# EasyEDA Pro project ProDoc_ChisFlash-Pichu.epro

# Schematic ChisFlash-Pichu-圆角长金手指-二极管-隔离CS2
Board Name: ChisFlash-Pichu-圆角长金手指-二极管-隔离CS2; Create Date: 2024-10-19; Page Name: P1; Project Name: ChisFlash V0.1 青春版 开源GBA烧录卡; Schematic Name: ChisFlash-Pichu-圆角长金手指-二极管-隔离CS2; Update Date: 2024-10-19; Company: ChisBread/ChisFlash-Prometheus; Drawed: ChisBread; Page Size: A4; Reviewed: ChisBread; Version: 2
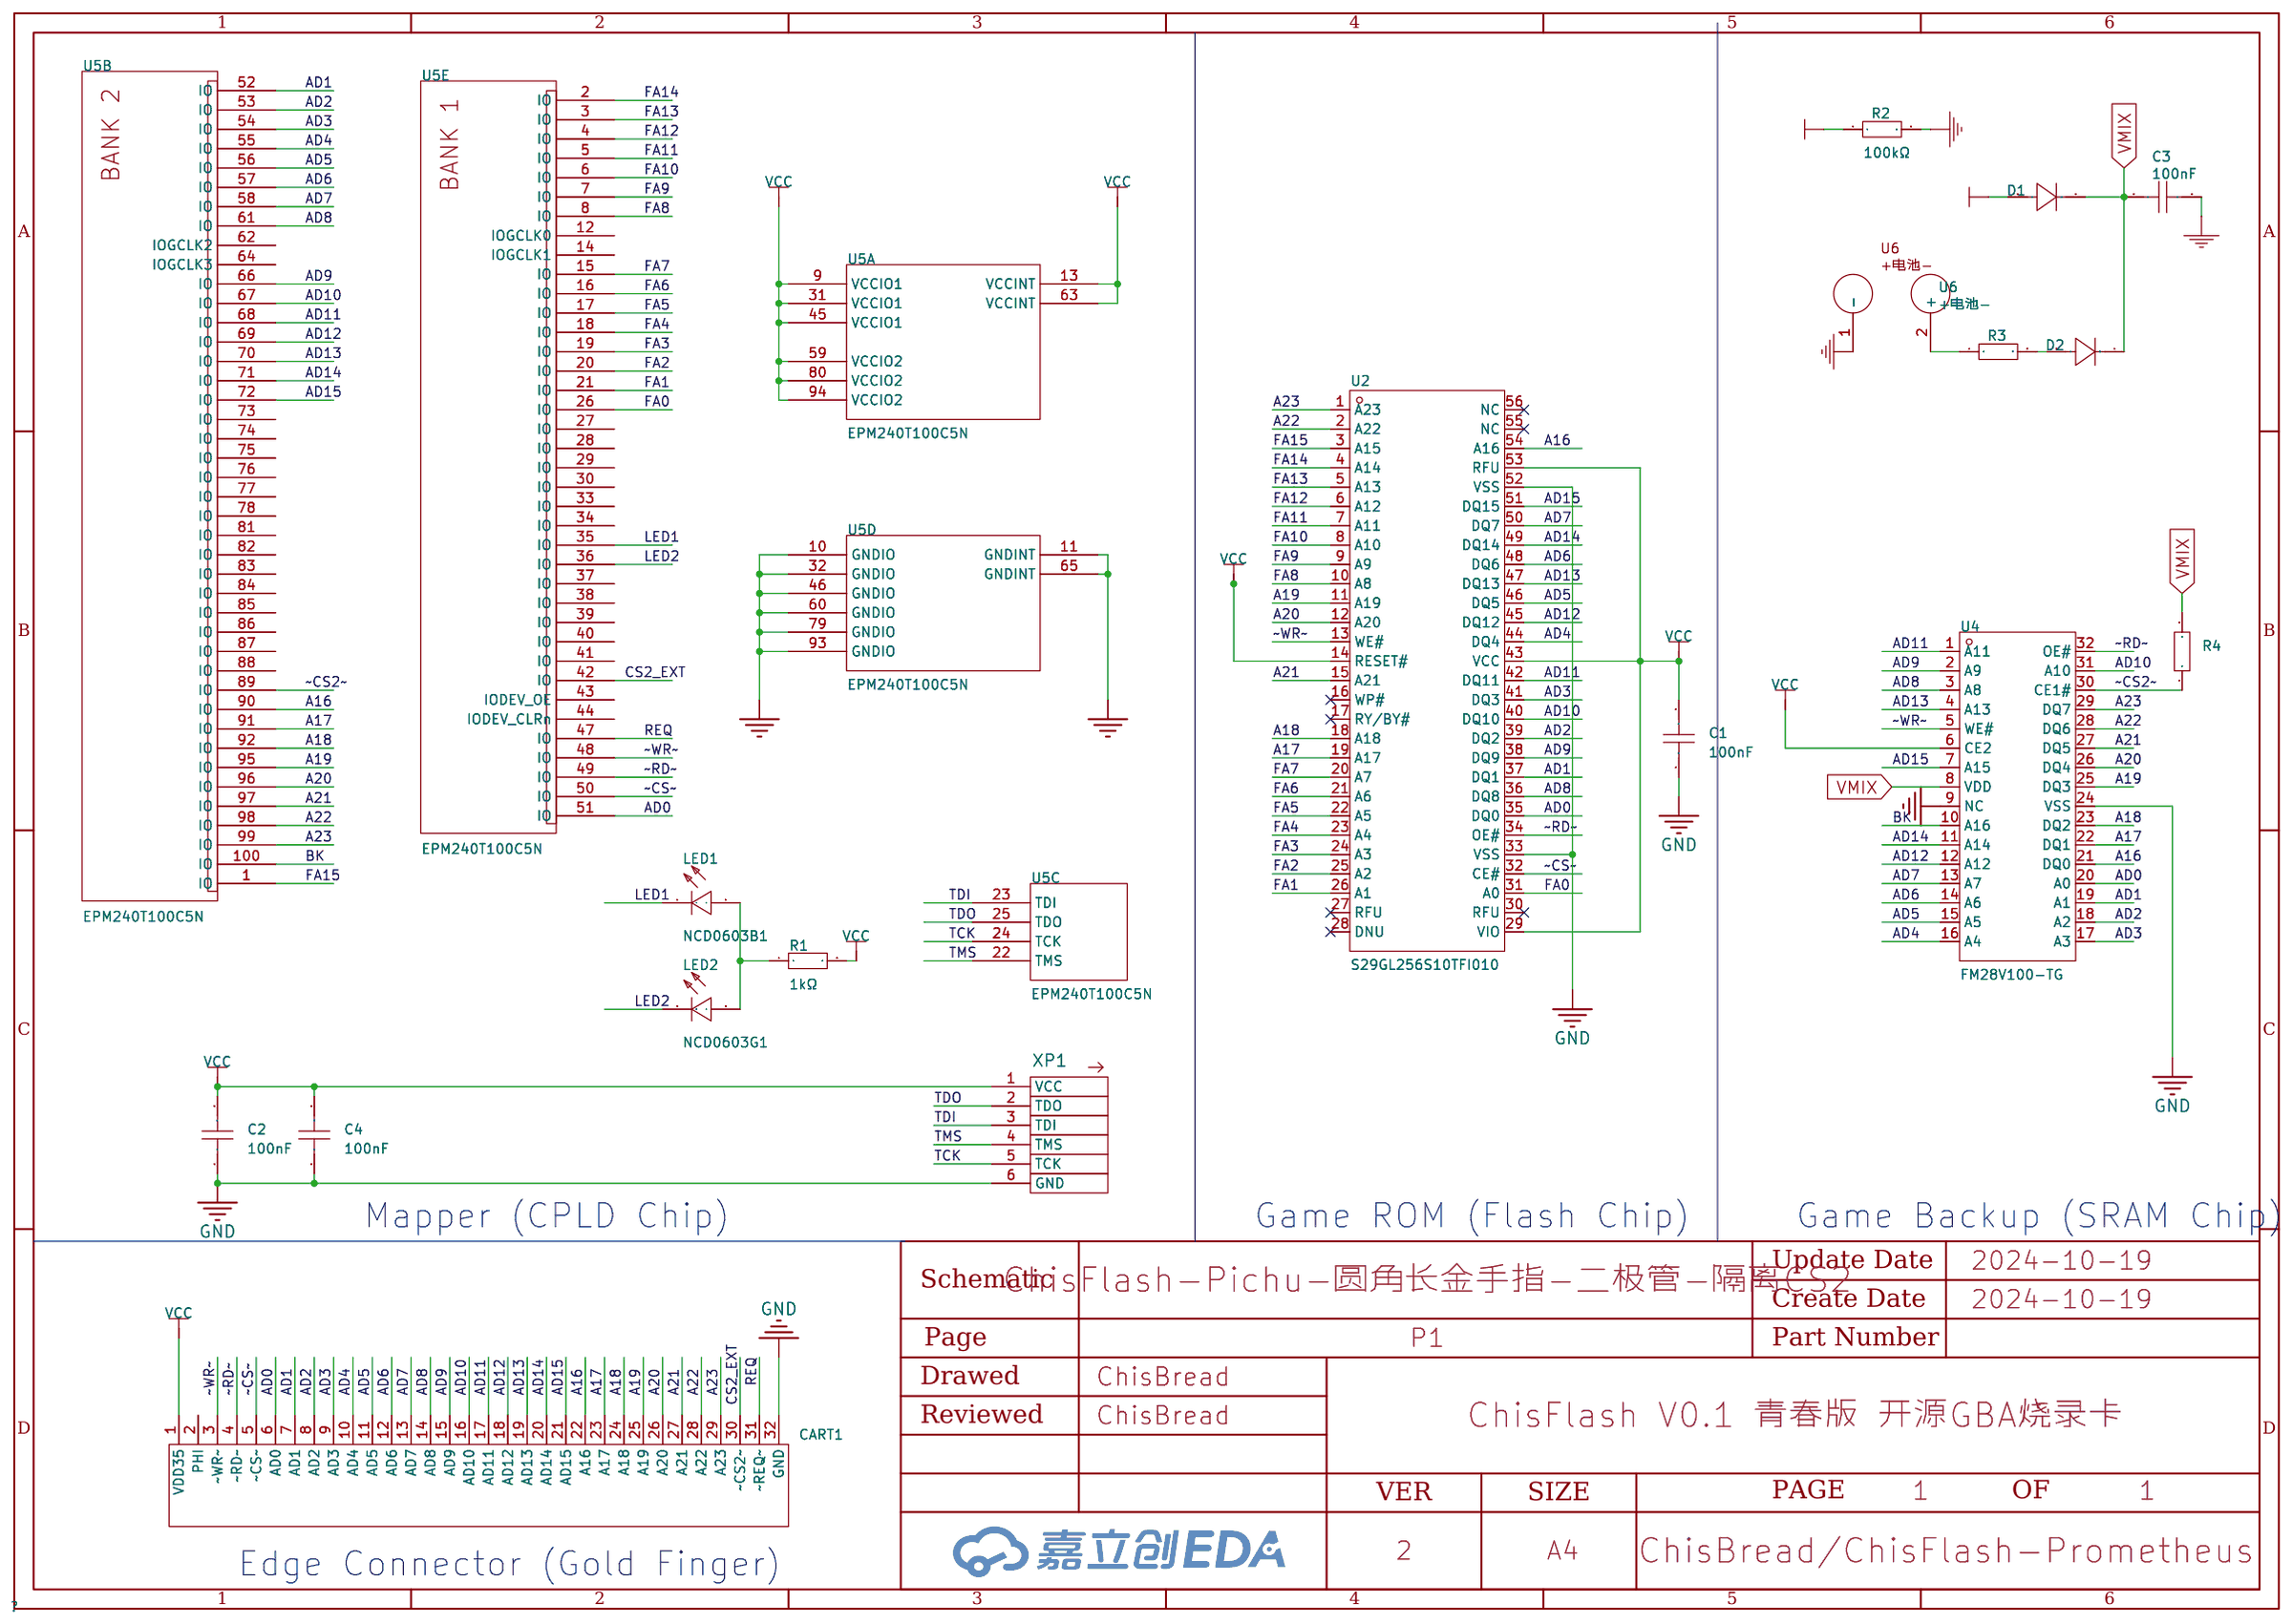
[diagram p0: schematic sheet]

## Parts
C1  100nF  [C0603]
C2  100nF  [C0603]
C3  100nF  [C0603]
C4  100nF  [C0603]
CART1  -  [GBA卡带金手指]  (no BOM)
D1  1N4148WS  [SOD-323_L1.8-W1.3-LS2.5-RD]
D2  1N4148WS  [SOD-323_L1.8-W1.3-LS2.5-RD]
LED1  NCD0603B1  [LED0603-RD]
LED2  NCD0603G1  [LED0603-RD]
R1  1kΩ  [R0603]
R2  100kΩ  [R0603]
R3  10kΩ  [R0603]
R4  10kΩ  [R0603]
U2  S29GL256S10TFI010  [TSOP-56_L18.4-W14.0-P0.50-LS20.0-TL]
U4  FM28V100-TG  [STSOP-32_L8.0-W11.8-P0.50-LS13.4-TL]
U5  EPM240T100C5N  [TQFP-100_L14.0-W14.0-P0.50-LS16.0-BL]  (sections 1,2,3,4,5)
U6  +电池-  [电池2]
XP1  JTAG  [HDR-TH_6P-P1.27-V-M-1]  (no BOM)

## Library data of the parts
C1 C2 C4 = CAP_0603: Supplier Footprint: 0603; Supplier Part: C14663
C3 = CGA0603X7R104K500JT: 容值:100nF;精度:±10%;额定电压:50V;材质(温度系数):X7R;; LCSC Part Name: 100nF ±10% 50V; Supplier Part: C14663; Manufacturer: HRE(芯声); Supplier Footprint: 0603; JLCPCB Part Class: Extended Part; Supplier: LCSC; Tolerance: ±10%; Voltage Rated: 50V; Temperature Coefficient: X7R
CART1 = GBA卡带金手指
D1 D2 = 1N4148WS_C917117: 二极管配置:独立式;正向压降(Vf):1.25V@150mA;直流反向耐压(Vr):100V;平均整流电流(Io):300mA;功率:400mW;反向恢复时间(trr):8ns;; LCSC Part Name: 电压:100V 电流:300mA; Supplier Part: C917117; Manufacturer: JSMSEMI(杰盛微); Supplier Footprint: SOD-323; JLCPCB Part Class: Extended Part; Datasheet: https://atta.szlcsc.com/upload/public/pdf/source/20230807/08D9F448A82EA88A23B325A669586A09.pdf; Supplier: LCSC; Diode Configuration: 独立式; Forward Voltage (Vf@If): 1.25V@150mA; Reverse Voltage (Vr): 100V; Average Rectified Current (Io): 300mA; Power Dissipation: 400mW; Reverse Leakage Current: 1uA@75V; Reverse Recovery Time (trr): 8ns; Operating Temperature: -55℃~+150℃@(Tj)
LED1 = NCD0603B1: 发光颜色:蓝色;正向电压(VF):2.6V~3.6V;功率:72mW;正向电流:10mA;主波长:463nm~475nm;透镜颜色:无色透明透镜;发光强度:80mcd~220mcd;发光角度:130°;工作温度:-30℃~+85℃;; Supplier Part: C84266; Manufacturer: 国星光电; Supplier Footprint: 0603; JLCPCB Part Class: 扩展库; Datasheet: https://atta.szlcsc.com/upload/public/pdf/source/20200820/C84266_6A3CDBEFA72C6CAD68EDA53474ADAE6C.pdf; Supplier: LCSC; Emitted Color: 蓝色; Forward Voltage (VF): 2.6V~3.6V; Power Dissipation: 72mW; Forward Current: 10mA; Dominant Wavelength: 463nm~475nm; Lens Color: 无色透明透镜; Luminous Intensity: 80mcd~220mcd; Viewing Angle: 130°; Operating Temperature: -30℃~+85℃
LED2 = NCD0603G1: 发光颜色:翠绿色;正向电压(VF):2.6V~3.6V;功率:72mW;正向电流:10mA;主波长:515nm~530nm;透镜颜色:无色透明透镜;发光强度:330mcd~900mcd;发光角度:130°;工作温度:-30℃~+85℃;; Supplier Part: C84266; Manufacturer: 国星光电; Supplier Footprint: 0603; JLCPCB Part Class: 扩展库; Datasheet: https://atta.szlcsc.com/upload/public/pdf/source/20200820/C84267_04BA7703640BAC111D09F5EFB971FBF3.pdf; Supplier: LCSC; Emitted Color: 翠绿色; Forward Voltage (VF): 2.6V~3.6V; Power Dissipation: 72mW; Forward Current: 10mA; Dominant Wavelength: 515nm~530nm; Lens Color: 无色透明透镜; Luminous Intensity: 330mcd~900mcd; Viewing Angle: 130°; Operating Temperature: -30℃~+85℃
R1 = 0603WAF1001T5E: 电阻类型:厚膜电阻;阻值:1kΩ;精度:±1%;功率:100mW;最大工作电压:75V;温度系数:±100ppm/℃;; LCSC Part Name: 1kΩ ±1% 100mW 厚膜电阻; Supplier Part: C25803; Manufacturer: UNI-ROYAL(厚声); Supplier Footprint: 0603; JLCPCB Part Class: 基础库; Datasheet: https://atta.szlcsc.com/upload/public/pdf/source/20200306/C422600_1E6D84923E4A46A82E41ADD87F860B5C.pdf; Supplier: LCSC; Type: 厚膜电阻; Tolerance: ±1%; Power(Watts): 100mW; Overload Voltage (Max): 75V; Temperature Coefficient: ±100ppm/℃; Operating Temperature Range: -55℃~+155℃
R2 = 0603WAF1003T5E: 电阻类型:厚膜电阻;阻值:100kΩ;精度:±1%;功率:100mW;最大工作电压:75V;温度系数:±100ppm/℃;; LCSC Part Name: 100kΩ ±1% 100mW 厚膜电阻; Supplier Part: C25803; Manufacturer: UNI-ROYAL(厚声); Supplier Footprint: 0603; JLCPCB Part Class: Basic Part; Datasheet: https://atta.szlcsc.com/upload/public/pdf/source/20200306/C422600_1E6D84923E4A46A82E41ADD87F860B5C.pdf; Supplier: LCSC; Type: 厚膜电阻; Tolerance: ±1%; Power(Watts): 100mW; Overload Voltage (Max): 75V; Temperature Coefficient: ±100ppm/℃; Operating Temperature Range: -55℃~+155℃; Resistance: 47K
R3 R4 = 0603WAF1002T5E: 电阻类型:厚膜电阻;阻值:10kΩ;精度:±1%;功率:100mW;最大工作电压:75V;温度系数:±100ppm/℃;; LCSC Part Name: 厚膜电阻 10kΩ ±1% 100mW; Supplier Part: C25803; Manufacturer: UNI-ROYAL(厚声); Supplier Footprint: 0603; JLCPCB Part Class: Basic Part; Datasheet: https://atta.szlcsc.com/upload/public/pdf/source/20200306/C422600_1E6D84923E4A46A82E41ADD87F860B5C.pdf; Supplier: LCSC; Type: 厚膜电阻; Tolerance: ±1%; Power(Watts): 100mW; Overload Voltage (Max): 75V; Temperature Coefficient: ±100ppm/℃; Operating Temperature Range: -55℃~+155℃; Resistance: 47K
U2 = S29GL256S10TFI010: Supplier Part: C1350995; Manufacturer: SPANSION(飞索); Supplier Footprint: TSOP-56; JLCPCB Part Class: Extended Part; Datasheet: https://atta.szlcsc.com/upload/public/pdf/source/20201109/C914940_4A5E28132C9BE0EE19A790F58F84C86D.pdf; Supplier: LCSC
U4 = FM28V100-TG: Supplier Part: C2959453; Manufacturer: CYPRESS(赛普拉斯); Supplier Footprint: TFSOP-32; JLCPCB Part Class: 扩展库; Datasheet: https://atta.szlcsc.com/upload/public/pdf/source/20210608/2F2AEFEDCE558E0D37969C616959BD3C.pdf; Supplier: LCSC
U5 = EPM240T100C5N: 类型:其它PLD;逻辑门数量:-;逻辑单元数:-;逻辑阵列块数:240;; Supplier Part: C10041; Manufacturer: Intel/Altera; Supplier Footprint: TQFP-100(14x14); JLCPCB Part Class: 扩展库; Datasheet: https://atta.szlcsc.com/upload/public/pdf/source/20121123/1457706563537.pdf; Supplier: LCSC; Type: 其它PLD; Supply Voltage Range - VCCIO: 3.3V；2.5V; Logic Array Blocks: 240; Maximum Delay Time Tpd: 4.7ns; Operating Temperature Range: 0℃~+85℃
U6 = GBA烧录卡电池
XP1 = jtag

## Nets
GND: C1.1 C2.1 C3.2 C4.1 CART1.32(GND) R2.2 U2.33(VSS) U2.52(VSS) U4.9(NC) U4.24(VSS) U5.10(GNDIO) U5.11(GNDINT) U5.32(GNDIO) U5.46(GNDIO) U5.60(GNDIO) U5.65(GNDINT) U5.79(GNDIO) U5.93(GNDIO) U6.1(-) XP1.6(GND)
VCC: C1.2 C2.2 C4.2 CART1.1(VDD35) D1.2(A) R1.2 R2.1 U2.14(RESET#) U2.29(VIO) U2.43(VCC) U2.53(RFU) U4.6(CE2) U5.9(VCCIO1) U5.13(VCCINT) U5.31(VCCIO1) U5.45(VCCIO1) U5.59(VCCIO2) U5.63(VCCINT) U5.80(VCCIO2) U5.94(VCCIO2) XP1.1(VCC)
A16: CART1.22(A16) U2.54(A16) U4.21(DQ0) U5.90(IO)
A17: CART1.23(A17) U2.19(A17) U4.22(DQ1) U5.91(IO)
A18: CART1.24(A18) U2.18(A18) U4.23(DQ2) U5.92(IO)
A19: CART1.25(A19) U2.11(A19) U4.25(DQ3) U5.95(IO)
A20: CART1.26(A20) U2.12(A20) U4.26(DQ4) U5.96(IO)
A21: CART1.27(A21) U2.15(A21) U4.27(DQ5) U5.97(IO)
A22: CART1.28(A22) U2.2(A22) U4.28(DQ6) U5.98(IO)
A23: CART1.29(A23) U2.1(A23) U4.29(DQ7) U5.99(IO)
AD0: CART1.6(AD0) U2.35(DQ0) U4.20(A0) U5.51(IO)
AD1: CART1.7(AD1) U2.37(DQ1) U4.19(A1) U5.52(IO)
AD2: CART1.8(AD2) U2.39(DQ2) U4.18(A2) U5.53(IO)
AD3: CART1.9(AD3) U2.41(DQ3) U4.17(A3) U5.54(IO)
AD4: CART1.10(AD4) U2.44(DQ4) U4.16(A4) U5.55(IO)
AD5: CART1.11(AD5) U2.46(DQ5) U4.15(A5) U5.56(IO)
AD6: CART1.12(AD6) U2.48(DQ6) U4.14(A6) U5.57(IO)
AD7: CART1.13(AD7) U2.50(DQ7) U4.13(A7) U5.58(IO)
AD8: CART1.14(AD8) U2.36(DQ8) U4.3(A8) U5.61(IO)
AD9: CART1.15(AD9) U2.38(DQ9) U4.2(A9) U5.66(IO)
AD10: CART1.16(AD10) U2.40(DQ10) U4.31(A10) U5.67(IO)
AD11: CART1.17(AD11) U2.42(DQ11) U4.1(A11) U5.68(IO)
AD12: CART1.18(AD12) U2.45(DQ12) U4.12(A12) U5.69(IO)
AD13: CART1.19(AD13) U2.47(DQ13) U4.4(A13) U5.70(IO)
AD14: CART1.20(AD14) U2.49(DQ14) U4.11(A14) U5.71(IO)
AD15: CART1.21(AD15) U2.51(DQ15) U4.7(A15) U5.72(IO)
BK: U4.10(A16) U5.100(IO)
CS2_EXT: CART1.30(~CS2~) U5.42(IO)
FA0: U2.31(A0) U5.26(IO)
FA1: U2.26(A1) U5.21(IO)
FA2: U2.25(A2) U5.20(IO)
FA3: U2.24(A3) U5.19(IO)
FA4: U2.23(A4) U5.18(IO)
FA5: U2.22(A5) U5.17(IO)
FA6: U2.21(A6) U5.16(IO)
FA7: U2.20(A7) U5.15(IO)
FA8: U2.10(A8) U5.8(IO)
FA9: U2.9(A9) U5.7(IO)
FA10: U2.8(A10) U5.6(IO)
FA11: U2.7(A11) U5.5(IO)
FA12: U2.6(A12) U5.4(IO)
FA13: U2.5(A13) U5.3(IO)
FA14: U2.4(A14) U5.2(IO)
FA15: U2.3(A15) U5.1(IO)
LED1: LED1.1(-) U5.35(IO)
LED2: LED2.1(K) U5.36(IO)
REQ: CART1.31(~REQ~) U5.47(IO)
TCK: U5.24(TCK) XP1.5(TCK)
TDI: U5.23(TDI) XP1.3(TDI)
TDO: U5.25(TDO) XP1.2(TDO)
TMS: U5.22(TMS) XP1.4(TMS)
VMIX: C3.1 D1.1(C) D2.1(C) R4.2 U4.8(VDD)
~CS2~: R4.1 U4.30(CE1#) U5.89(IO)
~CS~: CART1.5(~CS~) U2.32(CE#) U5.50(IO)
~RD~: CART1.4(~RD~) U2.34(OE#) U4.32(OE#) U5.49(IO)
~WR~: CART1.3(~WR~) U2.13(WE#) U4.5(WE#) U5.48(IO)
$1N77583: LED1.2(+) LED2.2(A) R1.1
$1N81263: D2.2(A) R3.2
$1N81264: R3.1 U6.2(+)

Not connected (* = marked no-connect by the designer): CART1 2(PHI); U2 16(WP#)* 17(RY/BY#)* 27(RFU)* 28(DNU)* 30(RFU)* 55(NC)* 56(NC)*; U5 12(IOGCLK0) 14(IOGCLK1) 27(IO) 28(IO) 29(IO) 30(IO) 33(IO) 34(IO) 37(IO) 38(IO) 39(IO) 40(IO) 41(IO) 43(IODEV_OE) 44(IODEV_CLRn) 62(IOGCLK2) 64(IOGCLK3) 73(IO) 74(IO) 75(IO) 76(IO) 77(IO) 78(IO) 81(IO) 82(IO) 83(IO) 84(IO) 85(IO) 86(IO) 87(IO) 88(IO)

## Notes on the sheet
- Mapper (CPLD Chip)
- Game ROM (Flash Chip)
- Game Backup (SRAM Chip)
- Edge Connector (Gold Finger)

# Board ChisFlash-Pichu-圆角长金手指-二极管-隔离CS2
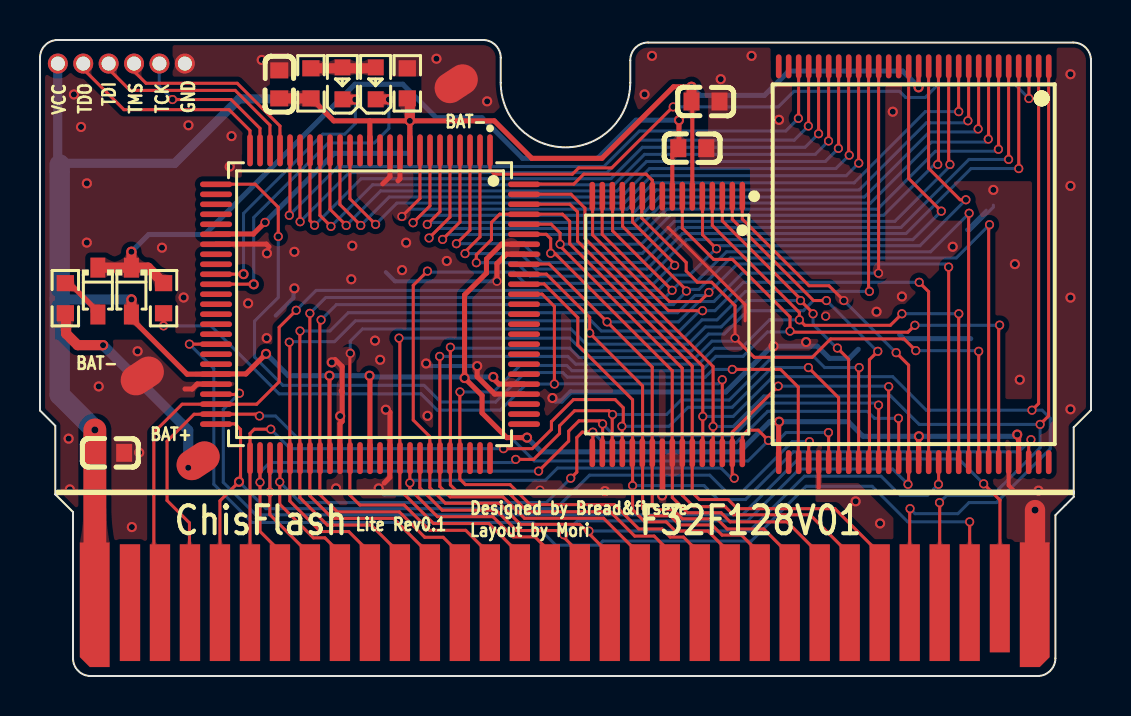
[diagram p1: board, top side]
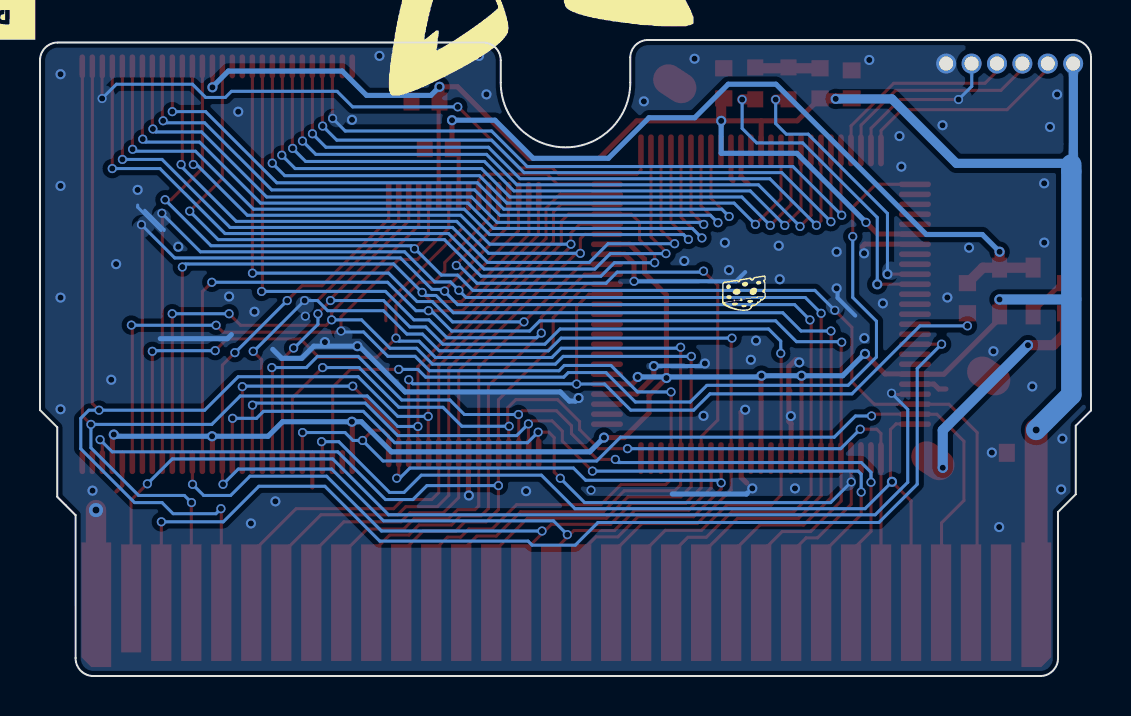
[diagram p2: board, bottom side, seen from below]

Outline 52.55 x 31.83 mm; copper layers: Top Layer, Bottom Layer. Coordinates in mm from the lower left corner of the outline.
Outline path: 0,30.94 0,13.28 0.76,12.52 0.76,9.09 1.65,8.2 1.65,0.89 arc(1.91,0.26) 2.54,0 49.88,0 arc(50.51,0.26) 50.77,0.89 50.77,8.05 51.28,8.56 51.69,8.97 51.69,12.45 52.55,13.31 52.55,30.81 arc(52.29,31.44) 51.66,31.7 30.4,31.7 arc(29.77,31.44) 29.51,30.81 29.51,29.69 arc(26.28,26.45) 23.04,29.69 23.04,30.94 arc(22.78,31.57) 22.15,31.83 0.89,31.83 arc(0.26,31.57) 0,30.94
Stack: Top Layer 0.035mm - / Dielectric1 1.51mm FR4 er 4.5 / Bottom Layer 0.035mm -

## Design rules (mm)
template: 自定义配置
spacing copperThickness1oz (default): track to track 0.152, other pairs 0.152 to 0.3
spacing copperThickness2oz: track to track 0.152, other pairs 0.152 to 0.3
track width copperThickness1oz (default): min 0.152, default 0.152, max 2.54
track width copperThickness2oz: min 0.152, default 0.254, max 2.54
differential pair differentialPair (default): width min 0.152, default 0.254, max 2.54; gap min 0.152, default 0.152
via viaSize (default): diameter min 0.406, default 0.508, max 10; hole min 0.305, default 0.305, max 6.299

## Placement (name value [footprint] x y rotation side)
C1  100nF  [C0603]  33.28 28.75 180 top
C2  100nF  [C0603]  11.96 29.6 270 top
C3  100nF  [C0603]  32.62 26.41 0 top
C4  100nF  [C0603]  3.51 11.17 180 top
CART1  -  [GBA卡带金手指]  26.22 3.04 0 top
D1  1N4148WS  [SOD-323_L1.8-W1.3-LS2.5-RD]  4.57 19.26 270 top
D2  1N4148WS  [SOD-323_L1.8-W1.3-LS2.5-RD]  2.89 19.26 270 top
LED1  NCD0603B1  [LED0603-RD]  15.13 29.66 90 top
LED2  NCD0603G1  [LED0603-RD]  16.79 29.66 90 top
NOREF  -  [Pad_e80923]  20.81 29.64 33.3 top
R1  1kΩ  [R0603]  13.55 29.66 270 top
R2  100kΩ  [R0603]  18.37 29.66 90 top
R3  10kΩ  [R0603]  1.27 18.91 90 top
R4  10kΩ  [R0603]  6.18 18.91 90 top
U2  S29GL256S10TFI010  [TSOP-56_L18.4-W14.0-P0.50-LS20.0-TL]  43.69 20.6 270 top
U4  FM28V100-TG  [STSOP-32_L8.0-W11.8-P0.50-LS13.4-TL]  31.37 17.59 270 top
U5  EPM240T100C5N  [TQFP-100_L14.0-W14.0-P0.50-LS16.0-BL]  16.5 18.6 180 top
U6  +电池-  [电池2]  5.11 15.02 303.3 top
XP1  JTAG  [HDR-TH_6P-P1.27-V-M-1]  4.07 30.65 0 top

## Footprints (pads in the part's own frame, mm; a bottom-side part is the same pattern mirrored in y, then rotated)
C0603
  rect 0.8x0.9 smd: 1(-0.7,0) 2(0.7,0)
GBA卡带金手指
  custom 1.491x6.239 smd: 1(-23.48,0.522)
  rect 1.016x5.842 smd: 2(-21.718,0.626) 3(-20.218,0.626) 4(-18.718,0.626) 5(-17.219,0.626) 6(-15.72,0.626) 7(-14.22,0.626) 8(-12.72,0.626) 9(-11.221,0.626) 10(-9.722,0.626) 11(-8.222,0.626) 12(-6.723,0.626) 13(-5.223,0.626) 14(-3.724,0.626) 15(-2.224,0.626) 16(-0.725,0.626) 17(0.775,0.626) 18(2.275,0.626) 19(3.774,0.626) 20(5.274,0.626) 21(6.773,0.626) 22(8.273,0.626) 23(9.772,0.626) 24(11.271,0.626) 25(12.771,0.626) 26(14.271,0.626) 27(15.77,0.626) 28(17.27,0.626) 29(18.769,0.626) 30(20.268,0.626)
  rect 1.001x5.407 smd: 31(21.776,0.844)
  custom 1.492x6.239 smd: 32(23.522,0.522)
HDR-TH_6P-P1.27-V-M-1
  round 1 hole 0.7: 1(-3.175,0) 2(-1.905,0) 3(-0.635,0) 4(0.635,0) 5(1.905,0) 6(3.175,0)
LED0603-RD
  rect 0.8x0.8 smd: 1(-0.799,0) 2(0.799,0)
Pad_e80923
  oval 2.286x1.524 smd: 2(0,0)
R0603
  rect 0.806x0.864 smd: 1(-0.753,0) 2(0.753,0)
SOD-323_L1.8-W1.3-LS2.5-RD
  rect 1x0.75 smd: 1(-1.173,0) 2(1.173,0)
STSOP-32_L8.0-W11.8-P0.50-LS13.4-TL
  oval 1.44x0.28 smd: 1(-6.42,3.75) 2(-6.42,3.25) 3(-6.42,2.75) 4(-6.42,2.25) 5(-6.42,1.75) 6(-6.42,1.25) 7(-6.42,0.75) 8(-6.42,0.25) 9(-6.42,-0.25) 10(-6.42,-0.75) 11(-6.42,-1.25) 12(-6.42,-1.75) 13(-6.42,-2.25) 14(-6.42,-2.75) 15(-6.42,-3.25) 16(-6.42,-3.75) 17(6.42,-3.75) 18(6.42,-3.25) 19(6.42,-2.75) 20(6.42,-2.25) 21(6.42,-1.75) 22(6.42,-1.25) 23(6.42,-0.75) 24(6.42,-0.25) 25(6.42,0.25) 26(6.42,0.75) 27(6.42,1.25) 28(6.42,1.75) 29(6.42,2.25) 30(6.42,2.75) 31(6.42,3.25) 32(6.42,3.75)
TQFP-100_L14.0-W14.0-P0.50-LS16.0-BL
  oval 0.28x1.6 smd: 1(-6,-7.7) 2(-5.5,-7.7) 3(-5,-7.7) 4(-4.5,-7.7) 5(-4,-7.7) 6(-3.5,-7.7) 7(-3,-7.7) 8(-2.5,-7.7) 9(-2,-7.7) 10(-1.5,-7.7) 11(-1,-7.7) 12(-0.5,-7.7) 13(0,-7.7) 14(0.5,-7.7) 15(1,-7.7) 16(1.5,-7.7) 17(2,-7.7) 18(2.5,-7.7) 19(3,-7.7) 20(3.5,-7.7) 21(4,-7.7) 22(4.5,-7.7) 23(5,-7.7) 24(5.5,-7.7) 25(6,-7.7) 51(6,7.7) 52(5.5,7.7) 53(5,7.7) 54(4.5,7.7) 55(4,7.7) 56(3.5,7.7) 57(3,7.7) 58(2.5,7.7) 59(2,7.7) 60(1.5,7.7) 61(1,7.7) 62(0.5,7.7) 63(0,7.7) 64(-0.5,7.7) 65(-1,7.7) 66(-1.5,7.7) 67(-2,7.7) 68(-2.5,7.7) 69(-3,7.7) 70(-3.5,7.7) 71(-4,7.7) 72(-4.5,7.7) 73(-5,7.7) 74(-5.5,7.7) 75(-6,7.7)
  oval 1.6x0.28 smd: 26(7.7,-6) 27(7.7,-5.5) 28(7.7,-5) 29(7.7,-4.5) 30(7.7,-4) 31(7.7,-3.5) 32(7.7,-3) 33(7.7,-2.5) 34(7.7,-2) 35(7.7,-1.5) 36(7.7,-1) 37(7.7,-0.5) 38(7.7,0) 39(7.7,0.5) 40(7.7,1) 41(7.7,1.5) 42(7.7,2) 43(7.7,2.5) 44(7.7,3) 45(7.7,3.5) 46(7.7,4) 47(7.7,4.5) 48(7.7,5) 49(7.7,5.5) 50(7.7,6) 76(-7.7,6) 77(-7.7,5.5) 78(-7.7,5) 79(-7.7,4.5) 80(-7.7,4) 81(-7.7,3.5) 82(-7.7,3) 83(-7.7,2.5) 84(-7.7,2) 85(-7.7,1.5) 86(-7.7,1) 87(-7.7,0.5) 88(-7.7,0) 89(-7.7,-0.5) 90(-7.7,-1) 91(-7.7,-1.5) 92(-7.7,-2) 93(-7.7,-2.5) 94(-7.7,-3) 95(-7.7,-3.5) 96(-7.7,-4) 97(-7.7,-4.5) 98(-7.7,-5) 99(-7.7,-5.5) 100(-7.7,-6)
TSOP-56_L18.4-W14.0-P0.50-LS20.0-TL
  oval 1.199x0.28 smd: 1(-9.901,6.752) 2(-9.901,6.251) 3(-9.901,5.75) 4(-9.901,5.25) 5(-9.901,4.75) 6(-9.901,4.25) 7(-9.901,3.749) 8(-9.901,3.251) 9(-9.901,2.751) 10(-9.901,2.251) 11(-9.901,1.75) 12(-9.901,1.25) 13(-9.901,0.75) 14(-9.901,0.249) 15(-9.901,-0.249) 16(-9.901,-0.75) 17(-9.901,-1.25) 18(-9.901,-1.75) 19(-9.901,-2.251) 20(-9.901,-2.751) 21(-9.901,-3.248) 22(-9.901,-3.749) 23(-9.901,-4.25) 24(-9.901,-4.75) 25(-9.901,-5.25) 26(-9.901,-5.75) 27(-9.901,-6.251) 28(-9.901,-6.749) 29(9.901,-6.749) 30(9.901,-6.251) 31(9.901,-5.75) 32(9.901,-5.25) 33(9.901,-4.75) 34(9.901,-4.25) 35(9.901,-3.749) 36(9.901,-3.248) 37(9.901,-2.751) 38(9.901,-2.251) 39(9.901,-1.75) 40(9.901,-1.25) 41(9.901,-0.75) 42(9.901,-0.249) 43(9.901,0.249) 44(9.901,0.75) 45(9.901,1.25) 46(9.901,1.75) 47(9.901,2.251) 48(9.901,2.751) 49(9.901,3.251) 50(9.901,3.749) 51(9.901,4.25) 52(9.901,4.75) 53(9.901,5.25) 54(9.901,5.75) 55(9.901,6.251) 56(9.901,6.752)
电池2
  oval 1.524x2.286 smd: 1(0,0) 2(5.08,0)

## Nets
As in the schematic, except:
GND: C1.1 C2.1 C3.2 C4.1 CART1.32 NOREF.2 R2.2 U2.33 U2.52 U4.9 U4.24 U5.10 U5.11 U5.32 U5.46 U5.60 U5.65 U5.79 U5.93 U6.1 XP1.6

Pads without a net: CART1 2; U2 16 17 27 28 30 55 56; U5 12 14 27 28 29 30 33 34 37 38 39 40 41 43 44 62 64 73 74 75 76 77 78 81 82 83 84 85 86 87 88

## Via types
v1: diameter 0.457, hole 0.305, Top Layer to Bottom Layer, 130 vias
v2: diameter 0.508, hole 0.305, Top Layer to Bottom Layer, 83 vias
v3: diameter 0.711, hole 0.355, Top Layer to Bottom Layer, 2 vias

## Routing (per net, layer and track width the routed paths; a pad name or vN(x,y) marks a point on that pad's centre or on a via; arc(x,y) is an arc through that point)
GND: length 76.2
  Top Layer w0.152: 31.4,22.45 35.26,18.59 35.26,17.77
  Top Layer w0.203: 38.93,9.44 38.94,9.44 38.94,10.71 ; 48.74,9.24 48.44,9.54 48.44,10.71
  Top Layer w0.254: 8.8,21.61 11.32,21.61 11.45,21.48 ; 17.14,24.63 17.5,24.99 17.5,26.31 ; 17.5,10.91 17.5,13.2 17.39,13.3 ; v2(31.11,9.03) 31.13,9.05 31.13,10.88 ; 14.99,10.92 15,12.63 15.11,12.74 15.11,14.22 ; 8.8,14.61 7.86,14.61 7.61,14.36 7.25,14.36 ; 24.2,14.11 22.73,14.11 21.86,14.98 v2(21.86,15.51) ; v1(22.85,19.75) 22.85,20.64 23.32,21.11 24.2,21.11 ; 18,26.31 18,24.88 17.9,24.78 ; 15.11,14.22 15.06,14.27 ; 15.11,14.22 15.11,15.49 14.75,15.84 ; 17.21,9.66 17.49,9.94 17.49,10.73
  Top Layer w1.016: 49.75,2.94 v3(49.75,8.3)
  Bottom Layer w0.152: 47.67,23.56 47.67,23.46 46.5,22.29 ; 47.31,23.31 46.35,22.34 46.35,22.29
  Bottom Layer w0.203: 17.29,20.21 17.75,19.75 v1(22.85,19.75) ; 12.67,19.48 12.67,18.92 11.79,18.03 ; 19.32,15.56 19.37,15.51 v2(21.86,15.51)
  Bottom Layer w0.254: 46.54,16.88 43.19,16.88 42.98,17.08 ; 40.92,16.35 40.46,15.9 39.47,15.9 38.86,16.5 v2(36.68,16.5) 36.58,16.5 34.29,14.22 26.54,14.22 26.08,13.76 25.77,13.76 v2(25.62,13.91) ; 17.18,9.16 17.23,9.11 20.93,9.11
  vias: v1(25,9.3) v1(39.28,18.01) v2(1.43,11.88) v2(1.49,9.34) v2(1.7,29.1) v2(2.05,27.47) v2(2.34,24.65) v2(2.34,21.69) v2(2.94,14.49) v2(4.59,7.45) v2(4.88,16.25) v2(4.96,11.18) v2(6.1,21.43) v2(7.18,18.94) v2(7.42,27.56) v2(9.48,25.49) v2(9.58,27.02) v2(10.41,18.65) v2(11.09,30.83) v2(11.35,21.15) v2(11.33,16.91) v2(12.72,21.23) v2(12.72,19.4) v2(14.59,15.69) v2(14.8,9.39) v2(15.01,13.01) v2(15.56,19.85) v2(15.61,21.53) v2(16.75,16.78) v2(16.94,9.39) v2(17.01,15.82) v2(17.29,13.33) v2(18.1,20.31) v2(18.31,21.68) v2(19.31,15.64) v2(19.38,13.02) v2(19.82,30.89) v2(20.34,20.77) v2(22.36,28.75) v2(28.25,9.25) v2(30.23,29.1) v2(30.6,31.03) v2(34.04,29.87) v2(35.58,31.03) v2(36.95,27.83) v2(38.31,16.71) v2(40.78,8.74) v2(41.83,18.23) v2(42.01,7.64) v2(42.64,28.24) v2(43.1,18.99) v2(45.64,21.48) v2(47.67,24.32) v2(48.75,20.61) v2(48.99,14.83) v2(49.93,9.28) v2(51.53,30.11) v2(51.53,24.52) v2(51.53,18.94) v2(51.53,13.35)
VCC: length 179
  Top Layer w0.203: v2(14.47,15.03) 14.47,10.93 14.5,10.91 ; 32.58,28.75 32.62,28.71 U4.6 ; v2(43.93,29.46) 43.93,30.51
  Top Layer w0.254: v2(22.66,14.97) 22.66,14.89 22.94,14.61 24.2,14.61 ; 36.93,10.33 36.93,12.7 v2(36.96,12.73) ; 4.53,17.93 7.35,15.1 U5.45 8.79,15.12 10.3,15.12 v2(11.3,16.12) ; 24.2,21.61 23.07,21.61 22.33,20.86 22.33,20.16 21.23,19.07 v2(21.23,14.91) 22.1,14.04 22.1,13.16 23.34,11.93 v2(24.35,11.93) ; v2(16.48,15.03) 16.5,15.01 16.5,10.91 ; v1(11.25,22.7) 10.67,22.12 8.79,22.12 ; v2(48.86,12.08) 48.93,12.01 48.93,10.54 ; 43.93,10.54 43.93,11.98 v2(43.95,12) ; 16.49,27.78 v2(18.49,27.78) ; 16.49,27.78 16.49,26.32 ; 16.49,27.78 14.69,27.78 13.69,28.78 ; v2(18.49,27.78) 18.49,26.32 ; v2(18.49,27.78) 22.71,27.78 24.59,25.9 28.1,25.9 31.67,29.48 v2(32.58,29.48)
  Top Layer w0.508: v2(32.58,29.48) 32.58,28.75 ; v2(18.49,27.78) 18.49,28.78 R2.1 ; D1.2 4.53,18.05 4.53,17.93 4.58,17.93 v2(4.58,18.84) ; R1.2 13.55,28.9 C2.2
  Top Layer w1.143: 2.74,4.64 v3(2.74,12.31)
  Bottom Layer w0.254: v2(18.49,27.78) 18.49,26.17 18.48,26.15 14.71,26.15 v1(11.25,22.7) ; v2(22.66,14.97) 16.54,14.97 v2(16.48,15.03) v2(14.47,15.03) 12.42,15.03 11.32,16.12 v2(11.3,16.12) ; v2(32.58,29.48) 33.01,29.05 36.22,29.05 37.44,30.27 43.13,30.27 43.93,29.47 v2(43.93,29.46) ; v2(24.35,11.93) 25.06,11.22 34.98,11.22 36.48,12.73 v2(36.96,12.73) 40.42,12.73 41.15,12 v2(43.95,12) 48.78,12 v2(48.86,12.08)
  Bottom Layer w0.457: v2(12.77,28.88) 9.96,28.88 6.73,25.65 1.04,25.65 0.98,25.59 ; 0.88,30.6 0.88,25.34 0.98,25.24
  Bottom Layer w0.508: 0.98,18.86 1,18.84 v2(4.58,18.84)
  Bottom Layer w1.016: 2.74,12.31 0.98,14.07 0.98,25.59
A16: length 45
  Top Layer w0.152: 49.44,10.71 49.44,11.71 v1(49.55,11.83) ; 24.19,19.62 25.21,19.62 26.89,17.93 26.89,16.56 29.63,13.82 v1(29.63,9.53) 29.63,8.33 30.25,7.71 31.31,7.71 31.77,7.26 33.39,7.26 34.49,6.16 CART1.22
  Bottom Layer w0.152: v1(29.63,9.53) 33.21,9.53 33.9,8.83 35.27,8.83 37.66,11.22 48.94,11.22 v1(49.55,11.83)
A17: length 50.3
  Top Layer w0.152: CART1.23 35.99,6.14 35.07,7.05 34.11,7.05 33.6,7.56 31.97,7.56 31.52,8.02 30.5,8.02 30.13,8.39 30.13,14.52 v1(27.49,17.16) 27.49,17.95 25.33,20.11 24.2,20.11 ; 41.37,30.4 41.43,30.34 41.43,19.29 v1(41.47,19.24)
  Bottom Layer w0.152: v1(41.47,19.24) 35.27,19.24 33.85,17.82 33.1,17.82 32.2,16.93 27.72,16.93 v1(27.49,17.16)
A18: length 50.5
  Top Layer w0.152: 24.2,20.61 24.21,20.62 25.46,20.62 v1(28.35,17.72) 30.61,15.46 30.61,8.51 30.8,8.32 31.67,8.32 32.12,7.87 33.85,7.87 34.36,7.36 36.19,7.36 37.49,6.06 CART1.24 ; v1(41.93,20.16) 41.93,20.16 41.93,30.34
  Bottom Layer w0.152: v1(28.35,17.72) 31.92,17.72 32.94,18.74 33.7,18.74 35.12,20.16 v1(41.93,20.16)
A19: length 54.8
  Top Layer w0.152: U5.95 25.31,22.1 25.54,21.88 v1(25.54,21.15) 25.74,21.15 31.61,15.28 31.61,10.87 31.62,10.87 31.62,8.93 32.38,8.17 34.06,8.17 34.51,7.71 37.36,7.71 38.99,6.08 CART1.25 ; 45.44,30.51 45.44,25.66 v1(45.5,25.59)
  Bottom Layer w0.152: v1(45.5,25.59) 45.5,25.51 42.74,22.75 31.72,22.75 30.12,21.15 v1(25.54,21.15)
A20: length 54.6
  Top Layer w0.152: 24.2,22.61 25.56,22.61 26.01,22.16 v1(26.01,21.61) 26.01,21.51 32.11,15.4 32.11,9.05 32.68,8.48 34.26,8.48 34.67,8.07 38.5,8.07 40.49,6.08 CART1.26 ; 44.93,30.03 44.93,25.63 v1(44.89,25.59)
  Bottom Layer w0.152: v1(26.01,21.61) 30.07,21.61 31.52,23.05 42.18,23.05 44.72,25.59 v1(44.89,25.59)
A21: length 68.4
  Top Layer w0.152: CART1.27 41.99,6.13 39.74,8.37 34.87,8.37 34.41,8.83 32.97,8.83 32.61,9.19 32.61,15.51 26.49,21.63 26.49,22.75 26.13,23.11 22.99,23.11 22.57,22.7 22.57,21.84 21.82,21.08 v1(21.82,20.68) ; v1(45.07,23.26) 43.43,24.9 43.43,30.34
  Bottom Layer w0.152: v1(45.07,23.26) 43.64,21.84 32.33,21.84 30.5,20.01 24.5,20.01 23.83,20.68 v1(21.82,20.68)
A22: length 68.4
  Top Layer w0.152: 24.2,23.61 26.49,23.61 26.88,23.22 26.88,21.76 33.14,15.5 v1(33.14,12.99) 33.14,11.25 33.09,11.2 ; CART1.28 43.49,8.36 v1(43.5,8.37) ; 49.93,30.34 49.93,13.63 v1(49.6,13.3)
  Bottom Layer w0.152: v1(43.5,8.37) 43.75,8.12 45.9,8.12 46.45,8.68 47.82,8.68 50.51,11.37 50.51,12.89 50.11,13.3 v1(49.6,13.3) 44.32,13.3 42.64,14.98 36.65,14.98 34.66,12.99 v1(33.14,12.99)
A23: length 65.8
  Top Layer w0.152: 24.2,24.11 26.55,24.11 27.25,23.41 27.25,21.9 33.66,15.49 v1(33.66,12.49) 33.66,11.57 33.61,11.51 ; v1(44.98,8.68) 44.99,8.67 CART1.29 ; v1(50.01,12.59) 50.43,13.02 50.43,30.34
  Bottom Layer w0.152: v1(33.66,12.49) 34.67,12.49 36.19,14.01 42.54,14.01 43.96,12.59 v1(50.01,12.59) 50.01,11.42 47.62,9.03 45.33,9.03 v1(44.98,8.68)
AD0: length 47.7
  Top Layer w0.152: v1(38.42,15.43) 39.93,13.92 39.93,10.54 ; U5.51 10.5,12.14 10.72,12.35 v1(11.54,12.35) ; 29.11,11.22 29.11,12.48 v1(29.09,12.5) 29.16,12.57 29.16,13.43 28.76,13.83 26.67,13.83 25.57,12.73 25.57,12.34 24.61,11.38 v1(23.18,11.38) ; 10.5,10.71 10.5,3.1
  Bottom Layer w0.152: v1(29.09,12.5) 31.45,12.5 32.4,13.45 34.61,13.45 36.6,15.43 v1(38.42,15.43) ; v1(23.18,11.38) 12.52,11.38 v1(11.54,12.35)
AD1: length 47.6
  Top Layer w0.152: 28.61,11.22 28.61,13.07 v1(28.63,13.09) 28.44,13.27 26.73,13.27 25.98,12.52 25.98,12.13 24.68,10.84 v1(23.79,10.84) ; 40.93,10.54 40.93,15.41 v1(40.96,15.43) ; CART1.7 12,6.24 11,7.24 v1(11,9.7) 11,10.59 11.01,10.6
  Bottom Layer w0.152: v1(28.63,13.09) 31.33,13.09 32.06,13.81 34.47,13.81 36.65,15.99 38.68,15.99 39.24,15.43 v1(40.96,15.43) ; v1(11,9.7) 11,10.2 11.49,10.68 23.63,10.68 v1(23.79,10.84)
AD2: length 46.1
  Top Layer w0.152: v1(24.93,10.25) 26.43,11.76 26.43,12.25 26.95,12.77 27.98,12.77 v1(28.13,12.62) 28.13,11.24 28.11,11.22 ; CART1.8 13.5,6.07 11.49,8.08 v1(11.49,9.2) 11.49,10.9 ; v1(41.93,13.56) 41.94,13.55 41.94,10.71
  Bottom Layer w0.152: v1(28.13,12.62) 28.72,12.03 34.67,12.03 36.29,13.66 41.83,13.66 v1(41.93,13.56) ; v1(24.93,10.25) 11.64,10.25 11.49,10.1 v1(11.49,9.2)
AD3: length 46.9
  Top Layer w0.152: v1(42.92,12.89) 42.94,12.88 42.94,10.71 ; 12,10.91 12,9.72 v1(11.99,9.71) 11.99,8.6 13.67,6.91 14.24,6.91 15,6.16 CART1.9 ; v1(26.54,9.9) 26.84,10.2 26.84,11.93 27.11,12.2 v1(27.64,12.2) 27.64,11.21 27.6,11.17
  Bottom Layer w0.152: v1(26.54,9.9) 25.32,8.68 13.02,8.68 v1(11.99,9.71) ; v1(42.92,12.89) 41.73,12.89 41.38,13.24 36.39,13.24 34.82,11.68 28.17,11.68 v1(27.64,12.2)
AD4: length 64.3
  Top Layer w0.152: v1(33.13,18.28) 31.42,18.28 27.63,22.07 27.63,24 U4.16 ; v1(12.47,16.7) 12.49,16.68 12.49,8.76 14.02,7.23 15.44,7.23 16.32,6.34 ; v1(43.96,19.7) 44.43,19.23 44.43,10.54
  Bottom Layer w0.152: v1(12.47,16.7) 12.49,16.73 14.73,16.73 15.77,17.77 27.56,17.77 28.07,17.26 31.97,17.26 32.99,18.28 v1(33.13,18.28) 33.75,18.28 35.17,19.7 v1(43.96,19.7)
AD5: length 66.9
  Top Layer w0.152: v1(33.45,19.19) 32.99,18.74 31.47,18.74 28.11,22.1 28.11,24.07 ; 17.79,6.32 16.56,7.55 14.37,7.55 12.99,8.93 12.99,17.26 ; 45.43,10.54 45.43,10.54 v1(45.43,20.46)
  Bottom Layer w0.152: 32.75,19.04 31.89,18.18 15.41,18.18 14.5,17.26 v1(13,17.26) ; 32.78,19.04 33.29,19.04 v1(33.45,19.19) 34.87,20.62 45.28,20.62 v1(45.43,20.46)
AD6: length 69.7
  Top Layer w0.152: v1(46.46,23.16) 46.43,23.13 46.43,10.54 ; U4.14 28.63,24 28.63,22.28 v1(31.61,19.3) ; v1(13.49,18.15) 13.49,18.15 13.49,9.02 14.63,7.89 17.68,7.89 19.26,6.3 19.3,6.3
  Bottom Layer w0.152: v1(46.46,23.16) 44.53,21.23 34.32,21.23 32.82,19.72 32.03,19.72 v1(31.61,19.3) 31.25,18.94 14.29,18.94 v1(13.49,18.15)
AD7: length 70.8
  Top Layer w0.152: 47.43,10.71 47.43,22.54 v1(47.48,22.58) ; 29.12,24.01 29.13,24 29.13,22.5 32.32,19.31 v1(32.32,19.26) ; v1(14.05,17.82) 13.99,17.76 13.99,9.08 14.86,8.21 17.97,8.21 19.24,6.94 20.16,6.94 21.26,5.84 21.26,5.78
  Bottom Layer w0.152: v1(14.05,17.82) 14.82,18.58 31.67,18.58 32.32,19.24 v1(32.32,19.26) 32.41,19.35 32.95,19.35 34.53,20.92 45.82,20.92 v1(47.48,22.58)
AD8: length 58.4
  Top Layer w0.152: U4.3 34.12,22.77 38.03,18.87 v1(38.03,18.79) 38.65,18.16 v1(38.65,18.12) ; v1(39.87,16.41) 40.43,15.85 40.43,10.54 ; v1(15.51,16.15) 15.49,16.12 15.49,9.06 15.99,8.56 18.21,8.56 19.48,7.29 21.29,7.29 22.49,6.08 CART1.14
  Bottom Layer w0.152: v1(39.87,16.41) 39.84,16.41 38.65,17.6 v1(38.65,18.12) ; v1(15.51,16.15) 15.51,16.76 16.12,17.37 26.55,17.37 27.31,16.6 32.4,16.6 33.27,17.47 34.06,17.47 35.38,18.79 v1(38.03,18.79)
AD9: length 56.9
  Top Layer w0.152: v1(17.95,16.91) 17.99,16.87 17.99,9.32 19.68,7.63 22.45,7.63 23.99,6.08 23.99,3.67 ; v1(41.89,16.25) 41.47,15.83 41.47,10.75 41.43,10.71 ; U4.2 34.62,22.85 38.68,18.79 v1(39.32,18.79)
  Bottom Layer w0.152: v1(41.89,16.25) 41.86,16.25 v1(39.32,18.79) 38.67,18.79 38.17,18.28 35.38,18.28 34.21,17.11 33.43,17.11 32.59,16.27 27.13,16.27 26.49,16.91 v1(17.95,16.91)
AD10: length 44.2
  Top Layer w0.152: 42.43,10.54 42.43,14.47 v1(42.44,14.48) ; v1(34.71,9.9) 34.61,10 34.61,11.17 ; CART1.16 25.49,6.22 24.75,6.96 23.66,6.96 22.65,7.97 19.88,7.97 18.49,9.36 v1(18.49,9.66) 18.49,10.91 U5.67 ; v1(36.91,14.5) 34.61,12.2 34.61,11.23
  Bottom Layer w0.152: v1(18.49,9.66) 18.62,9.8 25.27,9.8 25.88,10.41 34.06,10.41 34.56,9.9 v1(34.71,9.9) ; v1(36.91,14.5) 42.41,14.5 v1(42.44,14.48)
AD11: length 50.7
  Top Layer w0.152: 18.99,10.92 18.99,9.42 20.11,8.3 22.81,8.3 23.83,7.28 25.85,7.28 26.89,6.24 26.99,6.24 26.99,3.67 CART1.17 ; v1(42.81,16.18) 43.43,15.56 43.43,9.62 v1(43.4,9.59) ; v1(40.19,18.79) 39.45,19.53 38.45,19.53 35.12,22.87 U4.1
  Bottom Layer w0.152: v1(26.18,7.07) 26.87,7.76 35.38,7.76 37.97,10.35 42.64,10.35 v1(43.4,9.59) ; v1(42.81,16.18) 42.8,16.18 v1(40.19,18.79)
AD12: length 61.9
  Top Layer w0.152: U4.12 29.63,24 29.63,22.71 31.73,20.61 v1(31.73,20.54) ; 44.93,10.54 44.93,9.6 v1(44.93,9.59) ; v1(19.37,20.26) 18.66,19.55 18.66,12.81 19.49,11.98 19.49,9.42 20.27,8.64 22.97,8.64 24.02,7.59 26.99,7.59 28.34,6.24 28.47,6.24 28.47,3.7 CART1.18
  Bottom Layer w0.152: v1(27.45,7.26) 35.48,7.26 38.22,10 42.05,10 43.02,9.03 44.37,9.03 v1(44.93,9.59) ; v1(19.37,20.26) 19.42,20.21 23.69,20.21 24.25,19.65 30.7,19.65 31.6,20.54 v1(31.73,20.54)
AD13: length 63.2
  Top Layer w0.152: CART1.19 29.99,6.24 29.83,6.24 28.18,7.89 24.22,7.89 23.15,8.97 20.51,8.97 19.99,9.48 19.99,15.98 v1(19.98,15.99) ; U4.4 33.62,22.54 37.97,18.19 v1(37.97,17.82) 38.24,17.55 42.52,17.55 v1(43.1,18.13) ; v1(45.94,18.13) 45.94,18.12 45.94,10.71
  Bottom Layer w0.152: v1(37.97,17.82) 36.47,17.82 35.05,16.4 33.72,16.4 32.93,15.61 26.78,15.61 26.39,15.99 v1(19.98,15.99) ; v1(43.1,18.13) v1(45.94,18.13)
AD14: length 61.9
  Top Layer w0.152: v1(43.79,16.28) 43.21,16.87 39.53,16.87 38.61,15.95 35.71,15.95 v1(34.75,16.91) 34.75,18.53 33.58,19.71 32.87,19.71 32.31,20.26 32.31,20.69 30.09,22.91 30.09,23.62 ; 46.94,10.71 46.94,16.25 ; v1(20.52,16.45) 20.52,9.56 20.81,9.27 23.33,9.27 24.39,8.22 28.52,8.22 29.74,7 30.71,7 31.45,6.26 31.5,6.26
  Bottom Layer w0.152: v1(20.52,16.45) 20.57,16.4 26.49,16.4 26.96,15.94 32.78,15.94 33.6,16.76 34.6,16.76 v1(34.75,16.91) ; v1(46.94,16.25) 46.9,16.28 v1(43.79,16.28)
AD15: length 65.4
  Top Layer w0.152: v1(21,14.22) 20.99,14.21 20.99,9.85 21.27,9.58 23.51,9.58 24.51,8.58 28.72,8.58 29.94,7.36 31.11,7.36 31.52,6.95 32.18,6.95 32.99,6.14 32.99,3.67 ; 47.93,10.71 47.93,17.51 v1(47.98,17.56) ; U4.7 32.12,22.41 33.68,20.85 34.63,20.85 37.5,17.97 v1(37.5,17.26) 37.56,17.2 43.4,17.2 v1(43.75,17.55)
  Bottom Layer w0.152: v1(21,14.22) 22.68,14.22 24,15.54 26.34,15.54 26.6,15.28 33.08,15.28 33.8,16 35.16,16 36.38,17.22 37.46,17.22 v1(37.5,17.26) ; v1(43.75,17.55) 47.98,17.55 v1(47.98,17.56)
BK: length 7.6
  Top Layer w0.152: 24.19,24.62 26.69,24.62 27.18,25.11 30.31,25.11 30.62,24.8 U4.10
CS2_EXT: length 53.9
  Top Layer w0.152: CART1.30 v1(46.49,7.72) ; U5.42 8.8,16.61 v1(7.47,16.61)
  Bottom Layer w0.152: v1(7.47,16.61) 8.69,15.39 8.69,9.6 10.6,7.68 24.65,7.68 25.79,6.55 27.94,6.55 28.15,6.75 35.56,6.75 38.31,9.49 41.61,9.49 43.39,7.72 v1(46.49,7.72)
FA0: length 44.9
  Top Layer w0.152: 8.8,24.61 10.76,24.61 11.91,23.45 v1(11.91,21.99) ; v1(34.62,15.34) 37.03,15.34 37.92,14.46 37.92,10.53 37.92,10.53
  Bottom Layer w0.152: v1(34.62,15.34) 33.65,15.34 33.27,14.96 26.36,14.96 26.14,15.18 24.25,15.18 22.78,13.71 20.04,13.71 19.21,14.54 12.14,14.54 10.73,15.96 10.73,17.76 11.91,18.94 v1(11.91,21.99)
FA1: length 33.2
  Top Layer w0.152: 12.5,26.31 12.5,23.09 v1(12.47,23.05) ; 37.93,30.34 37.93,27.91 v1(37.92,27.9)
  Bottom Layer w0.152: v1(37.92,27.9) 37.29,27.27 29.97,27.27 28.19,25.49 14.9,25.49 v1(12.47,23.05)
FA2: length 33.8
  Top Layer w0.152: 38.43,30.34 38.43,27.53 v1(38.42,27.52) ; v1(13,22.73) 13,22.74 13,26.31
  Bottom Layer w0.152: v1(13,22.73) 15.46,25.19 28.35,25.19 29.97,26.81 37.71,26.81 v1(38.42,27.52)
FA3: length 34.2
  Top Layer w0.152: v1(13.73,22.55) 13.5,22.78 13.5,26.31 ; v1(38.93,27.13) 38.93,30.34
  Bottom Layer w0.152: v1(38.93,27.13) 38.25,26.46 30.12,26.46 28.55,24.88 16.06,24.88 v1(13.73,22.55)
FA4: length 34.3
  Top Layer w0.152: v1(14.55,22.5) 14,23.05 14,26.31 ; v1(39.43,26.77) 39.43,26.77 39.43,30.34
  Bottom Layer w0.152: v1(39.43,26.77) 38.76,26.1 30.23,26.1 28.7,24.58 16.63,24.58 v1(14.55,22.5)
FA5: length 34.3
  Top Layer w0.152: v1(39.92,26.4) 39.93,26.41 39.93,30.34 ; 14.5,26.31 14.5,23.36 v1(15.31,22.55)
  Bottom Layer w0.152: v1(15.31,22.55) 17.04,24.27 28.85,24.27 30.33,25.75 39.27,25.75 v1(39.92,26.4)
FA6: length 34.4
  Top Layer w0.152: 40.43,30.34 40.43,26.09 v1(40.46,26.06) ; 15,26.31 15,23.59 v1(16.04,22.55)
  Bottom Layer w0.152: v1(40.46,26.06) 39.79,25.39 30.48,25.39 29.06,23.97 17.46,23.97 v1(16.04,22.55)
FA7: length 34.4
  Top Layer w0.152: 15.5,26.31 15.5,23.88 v1(16.78,22.6) ; v1(40.94,25.66) 40.93,25.67 40.93,30.34
  Bottom Layer w0.152: v1(16.78,22.6) 17.85,23.66 29.21,23.66 30.58,25.04 40.31,25.04 v1(40.94,25.66)
FA8: length 35.8
  Top Layer w0.152: 45.93,30.34 45.93,28.25 v1(45.94,28.24) ; v1(18.09,22.99) 19,23.9 19,26.31
  Bottom Layer w0.152: v1(45.94,28.24) 44.27,28.24 40.71,24.68 30.68,24.68 29.36,23.36 18.46,23.36 v1(18.09,22.99)
FA9: length 36.4
  Top Layer w0.152: v1(46.4,27.78) 46.43,27.82 46.43,30.34 ; v1(18.65,22.68) 19.5,23.53 19.5,26.31
  Bottom Layer w0.152: v1(18.65,22.68) 19.03,23.05 29.55,23.05 30.82,24.32 40.96,24.32 44.32,27.68 46.3,27.68 v1(46.4,27.78)
FA10: length 36.5
  Top Layer w0.152: v1(46.91,27.37) 46.93,27.4 46.93,30.34 ; v1(19.36,22.6) 20,23.23 20,26.31
  Bottom Layer w0.152: v1(19.36,22.6) 19.47,22.7 29.7,22.7 30.97,23.97 41.22,23.97 44.47,27.22 46.76,27.22 v1(46.91,27.37)
FA11: length 38.3
  Top Layer w0.152: 47.43,30.34 47.43,26.88 v1(47.42,26.86) ; v1(19.45,21.92) 20.5,22.96 20.5,26.31
  Bottom Layer w0.152: v1(47.42,26.86) 47.27,26.72 44.57,26.72 41.52,23.66 31.15,23.66 29.88,22.39 19.93,22.39 v1(19.45,21.92)
FA12: length 38.5
  Top Layer w0.152: 47.93,30.34 47.93,26.36 v1(47.92,26.36) ; v1(20.13,21.85) 21,22.72 21,26.31
  Bottom Layer w0.152: v1(20.13,21.85) 20.37,22.09 30.07,22.09 31.34,23.36 41.88,23.36 44.78,26.26 47.83,26.26 v1(47.92,26.36)
FA13: length 39.6
  Top Layer w0.152: v1(20.82,21.63) 21.5,22.31 21.5,26.31 ; v1(48.43,25.85) 48.43,30.34
  Bottom Layer w0.152: v1(48.43,25.85) 46.45,25.85 43.05,22.45 31.92,22.45 30.17,20.69 25.09,20.69 24.15,21.63 v1(20.82,21.63)
FA14: length 40.5
  Top Layer w0.152: v1(48.94,25.39) 48.94,30.33 48.93,30.34 ; 22,26.31 22,21.97 21.25,21.23 v1(21.25,21.14)
  Bottom Layer w0.152: v1(48.94,25.39) 46.55,25.39 43.3,22.14 32.12,22.14 30.35,20.36 24.81,20.36 24.03,21.14 v1(21.25,21.14)
FA15: length 31.9
  Top Layer w0.152: v1(31.66,28.48) 31.64,28.48 28.59,25.43 26.94,25.43 26.62,25.11 22.71,25.11 22.5,25.32 U5.1 ; 49.43,30.34 49.45,30.32 v1(49.45,28.9)
  Bottom Layer w0.152: v1(31.66,28.48) 36.92,28.48 37.7,29.26 42.98,29.26 43.28,28.95 44.27,28.95 44.93,29.61 48.73,29.61 v1(49.45,28.9)
LED1: length 13.7
  Top Layer w0.152: v2(10.18,20.11) 8.8,20.11
  Top Layer w0.508: v1(15.77,28.85) 15.14,28.85 LED1.1
  Bottom Layer w0.152: v1(15.77,28.85) 15.77,27.65 15.23,27.11 14.14,27.11 10.18,23.15 v2(10.18,20.11)
LED2: length 15.9
  Top Layer w0.152: 8.8,19.61 10.68,19.61 v2(10.69,19.6)
  Top Layer w0.508: LED2.1 17.43,28.86 v1(17.44,28.85)
  Bottom Layer w0.152: v2(10.69,19.6) 10.69,22.95 14.42,26.67 16.72,26.67 17.44,27.4 v1(17.44,28.85)
REQ: length 52.9
  Top Layer w0.152: 9.13,14.08 9.91,14.08 v1(9.97,14.15) ; v1(47.18,9.62) 48,8.8 48,3.1
  Bottom Layer w0.152: v1(9.97,14.15) 9.16,13.34 9.16,9.69 10.79,8.07 35.12,8.07 37.92,10.86 45.94,10.86 v1(47.18,9.62)
TCK: length 8.1
  Top Layer w0.152: v1(6.62,28.85) 9.56,28.85 11,27.4 11,26.31
  Bottom Layer w0.152: 5.96,30.6 5.96,29.51 v1(6.62,28.85)
TDI: length 10.7
  Top Layer w0.152: 3.42,30.6 3.42,30.38 4.5,29.3 9.76,29.3 11.5,27.56 11.5,26.31
TDO: length 10.8
  Top Layer w0.152: 10.5,26.31 10.5,27.29 9.46,28.34 4.2,28.34 2.15,30.38 2.15,30.6
TMS: length 10
  Top Layer w0.152: 12,26.31 12,27.52 9.86,29.66 5.3,29.66 4.69,30.27 4.69,30.6
VMIX: length 41.5
  Top Layer w0.203: U4.8 31.62,26.11 31.92,26.41
  Top Layer w0.254: 31.92,26.41 31.95,26.44 v2(31.95,27.81)
  Top Layer w0.508: D1.1 v2(4.57,21.23) ; D1.1 D2.1 ; D1.1 5.4,20.44 R4.2
  Bottom Layer w0.254: v2(31.95,27.81) 29.8,27.81 27.89,25.9 24.13,25.9 22.1,27.93 19.81,27.93 18.14,29.61 15.75,29.61 8.23,22.09 5.43,22.09 v2(4.57,21.23)
~CS2~: length 40.3
  Top Layer w0.152: 24.2,19.11 25.11,19.11 25.72,18.49 v1(25.72,14.61) ; U4.30 34.12,14.82 v1(34.11,14.83)
  Top Layer w0.203: 6.18,18.15 v1(6.18,17.52)
  Bottom Layer w0.152: v1(6.18,17.52) 8.55,17.52 11.95,14.12 19.05,14.12 19.87,13.3 23.02,13.3 24.32,14.61 v1(25.72,14.61) 25.73,14.62 33.91,14.62 v1(34.11,14.83)
~CS~: length 42.7
  Top Layer w0.152: v1(38.47,11.73) 38.44,11.69 38.44,10.71 ; CART1.5 9,8.77 v2(9.95,9.72) 10.03,9.79 10.03,12.34 9.75,12.62 8.79,12.62
  Bottom Layer w0.152: v2(9.95,9.72) 11.3,8.37 25.8,8.37 27.48,10.05 33.49,10.05 34.35,9.19 35.07,9.19 37.61,11.73 v1(38.47,11.73)
~RD~: length 48.7
  Top Layer w0.152: 35.13,10.93 35.13,12.04 35.4,12.3 35.91,12.3 v1(36.43,11.79) ; 8.77,13.1 7.7,13.1 6.35,11.75 6.35,8.78 7.47,7.66 7.47,3.12 7.5,3.1 ; v1(10.97,13.01) 10.88,13.1 U5.49 ; v1(39.42,12.18) 39.43,12.18 39.43,10.54
  Bottom Layer w0.152: v1(10.97,13.01) 11.78,13.01 12.84,11.95 23.52,11.95 24.71,10.76 35.4,10.76 v1(36.43,11.79) 36.9,11.79 37.3,12.18 v1(39.42,12.18)
~WR~: length 66.3
  Top Layer w0.152: v1(33.83,21.38) 33.13,22.08 33.13,23.71 33.11,23.73 ; v1(12.81,18.3) 11.96,17.45 11.96,14.72 10.83,13.6 7.11,13.6 5.69,12.19 5.69,3.4 6,3.1 ; 44.43,30.34 44.43,25.41 46.01,23.83 v1(46.3,23.83)
  Bottom Layer w0.152: v1(46.3,23.83) 44,21.53 33.98,21.53 v1(33.83,21.38) 33.8,21.38 32.48,20.06 31.67,20.06 30.91,19.3 13.8,19.3 v1(12.81,18.3)
$1N77583: length 3.3
  Top Layer w0.508: R1.1 16.74,30.41 LED2.2
$1N81263: length 2.5
  Top Layer w0.254: 2.69,18.09 2.69,18.44 1.47,19.66 1.06,19.66
$1N81264: length 11.7
  Top Layer w0.508: v2(3.15,16.56) 1.88,16.56 1.3,17.14 1.3,18.13 1.28,18.15 1.27,18.15 ; v2(7.41,10.42) 7.77,10.78 7.93,10.78
  Bottom Layer w0.508: v2(7.41,10.42) 7.41,12.3 v2(3.15,16.56)

## Copper pours and planes (outline as drawn; the poured copper is in the pictures)
GND on Top Layer: -4.15,34.18 57.93,34.18 57.93,-4.68 -4.15,-4.68
GND on Bottom Layer: -3.2,33.91 58.32,33.91 58.32,-5.11 -3.2,-5.11

Small or netless copper shapes (teardrops, artwork), in the pictures only: 407 on Top Layer, 171 on Bottom Layer

## Text on the board
Top Silkscreen Layer: Lite Rev0.1 | Designed by Bread&firseve | Layout by Mori | TDO | TDI | TMS | TCK | GND | BAT- | BAT+ | VCC | ChisFlash                F32F128V01
